# Altium schematic sheet PIANO_ELISE_01.SchDoc: Piano Elise
size A3; Date: 30/10/2022; DrawnBy: Wim Van Gool; DocumentNumber: 1; Revision: 01; SheetNumber: 1; SheetTotal: 1
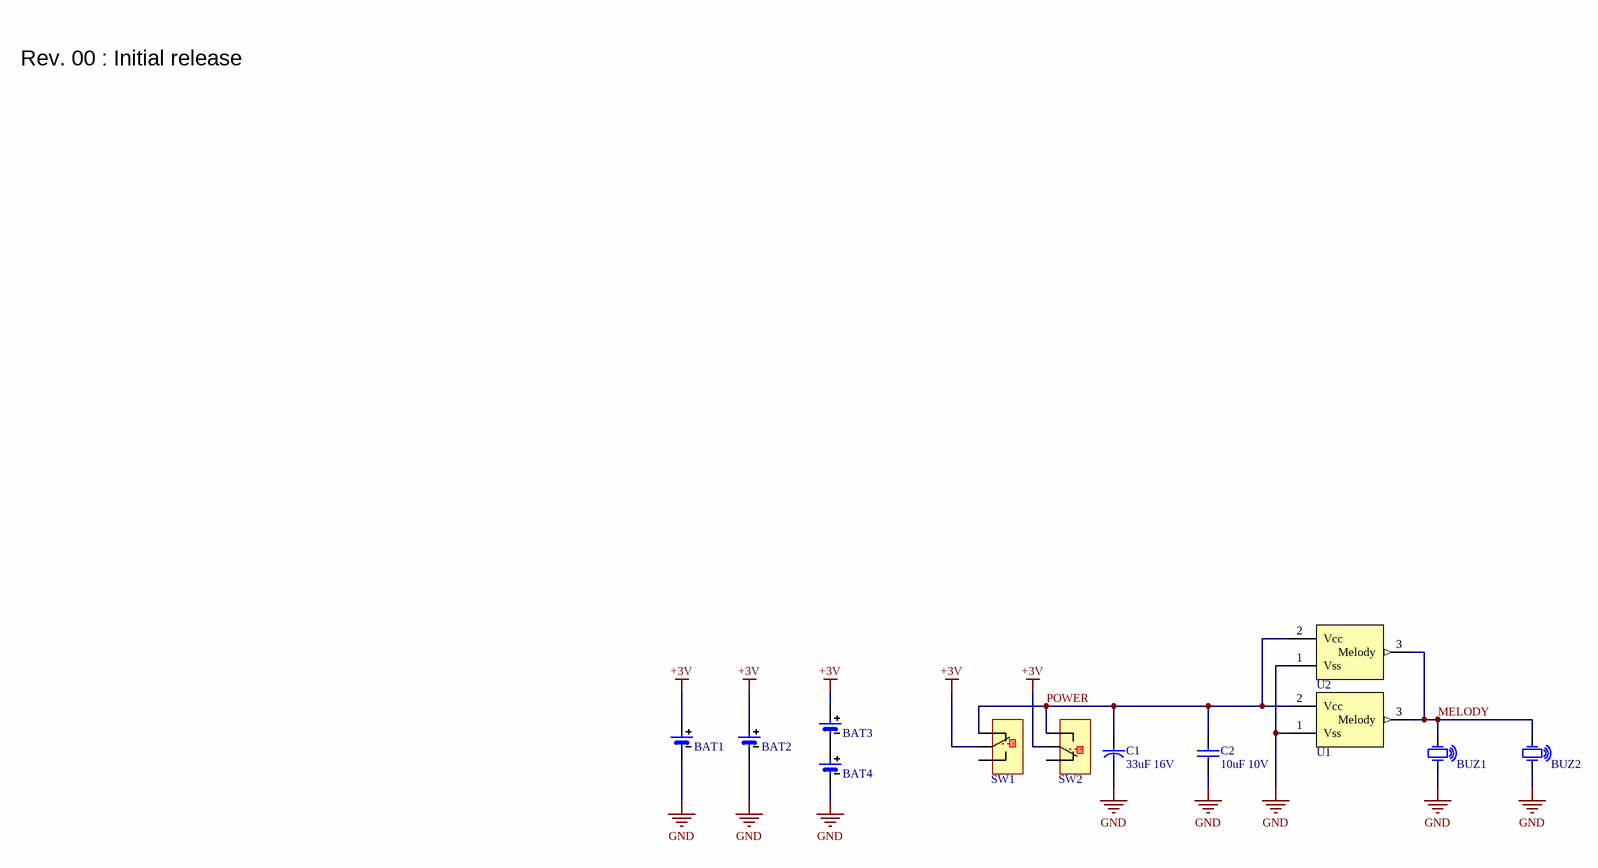
[diagram p0: PIANO_ELISE_01.SchDoc]

## Parts
BAT1  CR2032 Battery Holder  [BAT_CR2032]  (value not drawn)
BAT2  CR2032 SMD Battery Holder  [BAT_CR2032_KEY_1060]  (value not drawn)
BAT3  Single AAA battery holder  [KEY_2466]  (value not drawn)
BAT4  Single AAA battery holder  [KEY_2466]  (value not drawn)
BUZ1  12x12x3mm Piezo Buzzer Transducer 81dB  [CUI_CMT-1203-SMT]  (value not drawn)
BUZ2  14x14x7mm Piezo Buzzer Transducer 80dB  [CUI_CEP-1162]  (value not drawn)
C1  value 33uF 16V  [C_4x7_1.5mm]  (hidden comment: CAP_POL)
C2  value 10uF 10V  [C0805_N]  (hidden comment: CAP_CERAMIC)
SW1  XKB Connectivity DM1-135P-1-16 Micro Switch 12.7mm 0.1A 30V  [WE_463092370402]  (value not drawn)
SW2  XKB Connectivity DM1-135P-1-16 Micro Switch 12.7mm 0.1A 30V  [WE_463092370402]  (value not drawn)
U1  UM66T - Fur Elise  [TO-92A]  (value not drawn)
U2  UM66T - Fur Elise  [TO-92A_WIDE]  (value not drawn)

## Nets
+3V: BAT1.1 BAT2.1 BAT3.1 SW1.2 SW2.2
GND: BAT1.2 BAT2.2 BAT4.2 BUZ1.2(OSC2) BUZ2.2(OSC2) C1.2 C2.2 U1.1(Vss) U2.1(Vss)
MELODY: BUZ1.1(OSC1) BUZ2.1(OSC1) U1.3(Melody) U2.3(Melody)
POWER: C1.1 C2.1 SW1.1 SW2.3 U1.2(Vcc) U2.2(Vcc)
NetBAT3_2: BAT3.2 BAT4.1

Not connected (* = marked no-connect by the designer): SW1 3; SW2 1

## Notes on the sheet
- Rev. 00 : Initial release
- Title
- Revision
- Date
- Dranw By
- Size
- A3
- Sheet
- of

## Library data of the parts
BAT1 = BAT 20mm Coin Cell Holder Generic: =Description; Value: CR2032; Supplier 1: China
BAT2 = BAT # 20mm Coin Cell Holder Keystone 1060: =Description; Value: CR2032; Supplier 1: Digi-key; Supplier Part Number 1: 36-1060-ND; Supplier 2: LCSC; Supplier Part Number 2: C70377
BAT3 BAT4 = BAT AAA Keystone 2466: =Description; Value: 2466; Supplier 1: Digi-key; Supplier Part Number 1: 36-2466-ND
BUZ1 = BUZ # CUI CMT-1203-SMT: Crystal Oscillator; Value: CMT-1203-SMT; Supplier 1: Digi-key; Supplier Part Number 1: 102-2197-1-ND; Supplier 2: LCSC; Supplier Part Number 2: C409829; Supplier 3: LCSC; Supplier Part Number 3: C391037
BUZ2 = BUZ CUI CEP-1162: Crystal Oscillator; Value: CMT-1203-SMT; Supplier 1: Digi-key; Supplier Part Number 1: 102-1134-ND; Supplier 2: LCSC; Supplier Part Number 2: C360604
C1 = CAP 33uF 16V 4x7: Capacitor electrolyt; Supplier 1: LCSC; Supplier Part Number 1: C3314
C2 = CAP # 10uF 10V 0805: Capacitor Ceramic; Supplier 1: Farnell; Supplier Part Number 1: 2320859; Supplier 2: LCSC; Supplier Part Number 2: C17024; Supplier 3: Generic; Supplier Part Number 3: 10uF 10V 0805 X7R
SW1 SW2 = SW Micro DM1-135P-1-16: Value: DM1-135P-1-16; Supplier 1: LCSC; Supplier Part Number 1: C2906291; Supplier 2: LCSC; Supplier Part Number 2: C480264
U1 U2 = SOUND UM66T-19L: =Description; Value: UM66T-19L; Supplier 1: LCSC; Supplier Part Number 1: C136140